# Altium project GMAX2518_MB.PrjPcb
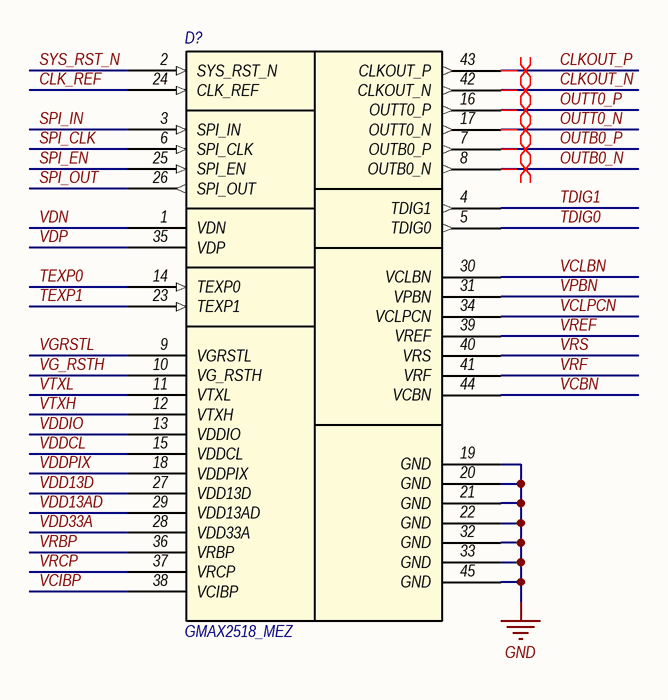
[diagram p0: Sheet1_GMAX2518_MB.SchDoc]
1 sheet, 1 parts. Net scope: global (net labels, ports and power ports of the same name join across sheets).
Board file: GMAX2518_MB.PcbDoc

## Sheet Sheet1_GMAX2518_MB.SchDoc
size A4; SheetNumber: 1; SheetTotal: 1

### Parts
D?  GMAX2518_MEZ  [GMAX2518_MEZ]

### Nets
GND: D?.19(GND) D?.20(GND) D?.21(GND) D?.22(GND) D?.32(GND) D?.33(GND) D?.45(GND)
CLK_REF: D?.24(CLK_REF)
CLKOUT_N: D?.42(CLKOUT_N)
CLKOUT_P: D?.43(CLKOUT_P)
OUTB0_N: D?.8(OUTB0_N)
OUTB0_P: D?.7(OUTB0_P)
OUTT0_N: D?.17(OUTT0_N)
OUTT0_P: D?.16(OUTT0_P)
SPI_CLK: D?.6(SPI_CLK)
SPI_EN: D?.25(SPI_EN)
SPI_IN: D?.3(SPI_IN)
SPI_OUT: D?.26(SPI_OUT)
SYS_RST_N: D?.2(SYS_RST_N)
TDIG0: D?.5(TDIG0)
TDIG1: D?.4(TDIG1)
TEXP0: D?.14(TEXP0)
TEXP1: D?.23(TEXP1)
VCBN: D?.44(VCBN)
VCIBP: D?.38(VCIBP)
VCLBN: D?.30(VCLBN)
VCLPCN: D?.34(VCLPCN)
VDD13AD: D?.29(VDD13AD)
VDD13D: D?.27(VDD13D)
VDD33A: D?.28(VDD33A)
VDDCL: D?.15(VDDCL)
VDDIO: D?.13(VDDIO)
VDDPIX: D?.18(VDDPIX)
VDN: D?.1(VDN)
VDP: D?.35(VDP)
VG_RSTH: D?.10(VG_RSTH)
VGRSTL: D?.9(VGRSTL)
VPBN: D?.31(VPBN)
VRBP: D?.36(VRBP)
VRCP: D?.37(VRCP)
VREF: D?.39(VREF)
VRF: D?.41(VRF)
VRS: D?.40(VRS)
VTXH: D?.12(VTXH)
VTXL: D?.11(VTXL)

### Layout directives
differential pair: CLKOUT_N, CLKOUT_P, OUTB0_N, OUTB0_P, OUTT0_N, OUTT0_P